# EAGLE design rev09 (EAGLE 6.5.0)
CrypTech avalanche noise prototype Revision 08-STM32 (c) NORDUnet A/S 2014
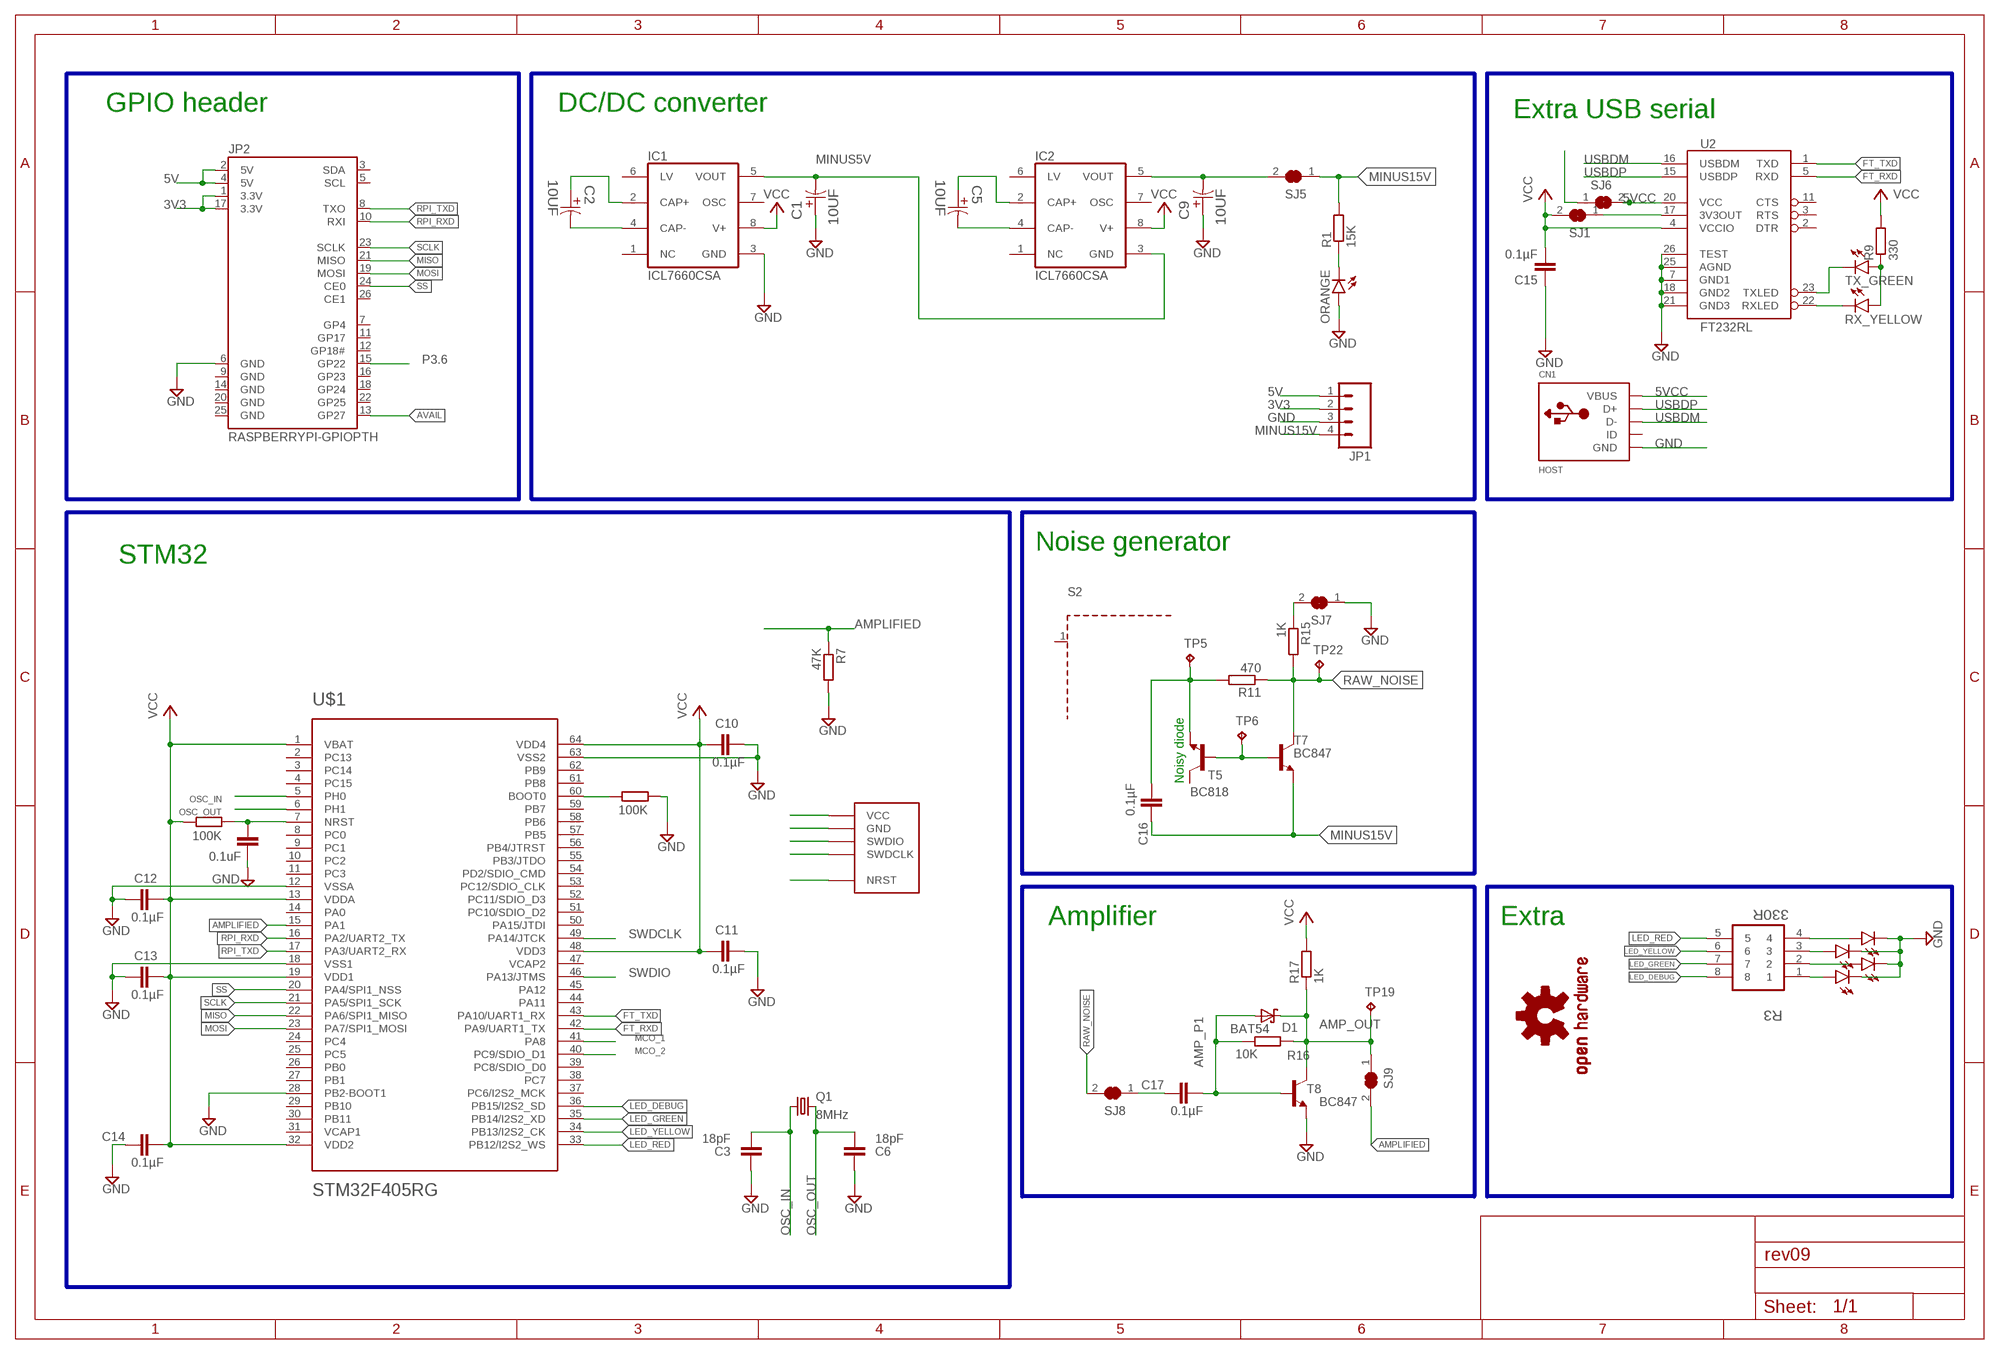
[diagram p0: schematic, sheet 1]

## Parts
C1  10UF  EEE-HA1E100R-CASE-C  [CAPAE530X610N]
C2  10UF  EEE-HA1E100R-CASE-C  [CAPAE530X610N]
C3  18pF  C-EUC0603  [C0603]
C4  0.1uF  C-EUC0603  [C0603]
C5  10UF  EEE-HA1E100R-CASE-C  [CAPAE530X610N]
C6  18pF  C-EUC0603  [C0603]
C9  10UF  EEE-HA1E100R-CASE-C  [CAPAE530X610N]
C10  0.1µF  C-EUC0603  [C0603]
C11  0.1µF  C-EUC0603  [C0603]
C12  0.1µF  C-EUC0603  [C0603]
C13  0.1µF  C-EUC0603  [C0603]
C14  0.1µF  C-EUC0603  [C0603]
C15  0.1µF  C-EUC0603  [C0603]
C16  0.1µF  C-EUC0603  [C0603]
C17  0.1µF  C-EUC0603  [C0603]
CN1  HOST  USBMINIB  [USB-MINIB]
D1  BAT54  [SOT23]
IC1  ICL7660CSA  [SO08]
IC2  ICL7660CSA  [SO08]
JP1  M04LOCK  [1X04_LOCK]
JP2  RASPBERRYPI-GPIOPTH  [2X13-SHROUDED]
LED5  LED0603  [LED-0603]
LED6  LED0603  [LED-0603]
LED7  LED0603  [LED-0603]
LED8  LED0603  [LED-0603]
LOGO1  OSHW-LOGOL  [OSHW-LOGO-L]
ORANGE  LED0603  [LED-0603]
Q1  8MHz  CRYSTALCTS406  [CTS406]
R1  15K  R-EU_R0603  [R0603]
R2  100K  R-EU_R0603  [R0603]
R3  330R  EXB38V331JV  [RESCAXE80P320X160X60-8N]
R7  47K  R-EU_R0603  [R0603]
R8  100K  R-EU_R0603  [R0603]
R9  330  R-EU_R0603  [R0603]
R11  470  R-EU_R0603  [R0603]
R15  1K  R-EU_R0603  [R0603]
R16  10K  R-EU_R0603  [R0603]
R17  1K  R-EU_R0603  [R0603]
RX_YELLOW  LED0603  [LED-0603]
S2  WE-SHC_36103205  [WE-SHC_36103205]
SJ1  SOLDERJUMPER_CLOSED  [SOLDERJUMPER_CLOSEDWIRE]
SJ5  SOLDERJUMPER_CLOSED  [SOLDERJUMPER_CLOSEDWIRE]
SJ6  SOLDERJUMPER_CLOSED  [SOLDERJUMPER_CLOSEDWIRE]
SJ7  SOLDERJUMPER_CLOSED  [SOLDERJUMPER_CLOSEDWIRE]
SJ8  SOLDERJUMPER_CLOSED  [SOLDERJUMPER_CLOSEDWIRE]
SJ9  SOLDERJUMPER_CLOSED  [SOLDERJUMPER_CLOSEDWIRE]
T5  BC818  BC818-40SMD  [SOT23-BEC]
T7  BC847  [SOT23]
T8  BC847  [SOT23]
TP5  TPB1,27  [B1,27]
TP6  TPB1,27  [B1,27]
TP19  TPB1,27  [B1,27]
TP22  TPB1,27  [B1,27]
TX_GREEN  LED0603  [LED-0603]
U2  FT232RL  FT232RL-BASICSSOP  [SSOP28DB]
U$1  STM32F405RG  [TQFP64]
U$2  STM32-SWD  [100MIL_THT]

## Nets
3V3: C10.1 C11.1 C12.2 C13.2 C14.2 C15.2 JP1.2 JP2.1(3.3V) JP2.17(3.3V) R2.2 R17.2 SJ1.2 U2.4(VCCIO) U$1.1(VBAT) U$1.13(VDDA) U$1.19(VDD1) U$1.32(VDD2) U$1.48(VDD3) U$1.64(VDD4) U$2.P$VCC(VCC) ; supply symbol labelled VCC
3V3OUT: R9.2 SJ1.1 U2.17(3V3OUT) ; supply symbol labelled VCC
5V: IC1.8(V+) IC2.8(V+) JP1.1 JP2.2(5V) JP2.4(5V) SJ6.1 ; supply symbol labelled VCC
5VCC: CN1.VBUS SJ6.2 U2.20(VCC)
AMP_OUT: D1.3(C) R16.2 R17.1 SJ9.1 T8.3(C) TP19.TP
AMP_P1: C17.2 D1.1(A) R16.1 T8.1(B)
AMPLIFIED: R7.1 SJ9.2 U$1.15(PA1)
AVAIL: JP2.13(GP27)
BOOT0: R8.2 U$1.60(BOOT0)
FT_RXD: U2.5(RXD) U$1.42(PA9/UART1_TX)
FT_TXD: U2.1(TXD) U$1.43(PA10/UART1_RX)
GND: C1.1 C3.1 C4.1 C6.1 C9.1 C10.2 C11.2 C12.1 C13.1 C14.1 C15.1 CN1.GND IC1.3(GND) JP1.3 JP2.6(GND) LED5.C LED6.C LED7.C LED8.C ORANGE.A R7.2 R8.1 SJ7.1 T8.2(E) U2.7(GND1) U2.18(GND2) U2.21(GND3) U2.25(AGND) U2.26(TEST) U$1.12(VSSA) U$1.18(VSS1) U$1.28(PB2-BOOT1) U$1.63(VSS2) U$2.P$GND(GND)
LED_DEBUG: R3.8 U$1.36(PB15/I2S2_SD)
LED_GREEN: R3.7 U$1.35(PB14/I2S2_XD)
LED_RED: R3.5 U$1.33(PB12/I2S2_WS)
LED_YELLOW: R3.6 U$1.34(PB13/I2S2_CK)
MCO_1: U$1.41(PA8)
MCO_2: U$1.40(PC9/SDIO_D1)
MINUS5V: C1.2 IC1.5(VOUT) IC2.3(GND)
MINUS15V: C16.1 JP1.4 R1.2 SJ5.1 T7.2(E)
MINUS15V_1: C9.2 IC2.5(VOUT) SJ5.2
MISO: JP2.21(MISO) U$1.22(PA6/SPI1_MISO)
MOSI: JP2.19(MOSI) U$1.23(PA7/SPI1_MOSI)
N$1: C5.2 IC2.4(CAP-)
N$2: C2.2 IC1.4(CAP-)
N$3: C2.1 IC1.2(CAP+)
N$7: ORANGE.C R1.1
N$9: C5.1 IC2.2(CAP+)
N$11: RX_YELLOW.C U2.22(RXLED)
N$12: TX_GREEN.C U2.23(TXLED)
N$13: R9.1 RX_YELLOW.A TX_GREEN.A
N$14: R15.1 SJ7.2
N$18: LED5.A R3.4
N$19: LED6.A R3.3
N$20: LED7.A R3.2
N$21: LED8.A R3.1
NOISE_IN1: C16.2 R11.2 T5.E TP5.TP
NOISE_OUT1: T5.B T7.1(B) TP6.TP
NRST: C4.2 R2.1 U$1.7(NRST) U$2.P$NRST(NRST)
OSC_IN: C3.2 Q1.1 U$1.5(PH0)
OSC_OUT: C6.2 Q1.3 U$1.6(PH1)
P3.6: JP2.15(GP22)
RAW_NOISE: R11.1 R15.2 SJ8.2 T7.3(C) TP22.TP
RAW_NOISE1: C17.1 SJ8.1
RPI_RXD: JP2.10(RXI) U$1.16(PA2/UART2_TX)
RPI_TXD: JP2.8(TXO) U$1.17(PA3/UART2_RX)
SCLK: JP2.23(SCLK) U$1.21(PA5/SPI1_SCK)
SS: JP2.24(CE0) U$1.20(PA4/SPI1_NSS)
SWDCLK: U$1.49(PA14/JTCK) U$2.P$SWDCLK(SWDCLK)
SWDIO: U$1.46(PA13/JTMS) U$2.P$SWDIO(SWDIO)
USBDM: CN1.D- U2.16(USBDM)
USBDP: CN1.D+ U2.15(USBDP)
Unconnected: CN1.ID IC1.1(NC) IC1.6(LV) IC1.7(OSC) IC2.1(NC) IC2.6(LV) IC2.7(OSC) JP2.3(SDA) JP2.5(SCL) JP2.7(GP4) JP2.11(GP17) JP2.12(GP18#) JP2.16(GP23) JP2.18(GP24) JP2.22(GP25) JP2.26(CE1) T5.C U2.2(DTR) U2.3(RTS) U2.11(CTS) U$1.2(PC13) U$1.3(PC14) U$1.4(PC15) U$1.8(PC0) U$1.9(PC1) U$1.10(PC2) U$1.11(PC3) U$1.14(PA0) U$1.24(PC4) U$1.25(PC5) U$1.26(PB0) U$1.27(PB1) U$1.29(PB10) U$1.30(PB11) U$1.31(VCAP1) U$1.37(PC6/I2S2_MCK) U$1.38(PC7) U$1.39(PC8/SDIO_D0) U$1.44(PA11) U$1.45(PA12) U$1.47(VCAP2) U$1.50(PA15/JTDI) U$1.51(PC10/SDIO_D2) U$1.52(PC11/SDIO_D3) U$1.53(PC12/SDIO_CLK) U$1.54(PD2/SDIO_CMD) U$1.55(PB3/JTDO) U$1.56(PB4/JTRST) U$1.57(PB5) U$1.58(PB6) U$1.59(PB7) U$1.61(PB8) U$1.62(PB9)

## Buses
B$1
B$2
B$3
B$4
B$5
B$7
B$6

## Notes on the sheet
- GPIO header | DC/DC converter | Extra USB serial
- Noise generator
- STM32
- Noisy diode
- Amplifier | Extra

## Power pins joined to a net without a drawn wire
GND: JP2.9(GND) JP2.14(GND) JP2.20(GND) JP2.25(GND) S2.1(GND)

## Library data of the parts
C1 C2 C5 C9 = Panasonic-EEEFT_EEEH:EEE-: Aluminum Electrolytic Capacitors,Surface Mount Type; MPN: EEE-HA1E100R; OC_FARNELL: 1973321; OC_NEWARK: 58T9232; PACKAGE: CASE-C; SUPPLIER: PANASONIC; TOLERANCE: ±20 %; VOLTAGERATING: 25V
C3 C4 C6 C10-C17 = rcl:C-EU: CAPACITOR, European symbol
CN1 = adafruit:USB: USB Connectors USBMINIB - Surface Mount Female Mini-B USB Connector 4UConnector: 06564 By microbuilder.eu Thru-hole RA Female Mini-B USB Connector 4UConnector: 18732 By ladyada.net
D1 = diode:BAT54: Schottky Diodes Source: Fairchild .. BAT54.pdf
IC1 IC2 = maxim:ICL7660CSA: VOLTAGE CONVERTER; MF: MAXIM; MPN: ICL7660CSA; OC_FARNELL: 9724710; OC_NEWARK: 34C3732
JP1 = SparkFun-Connectors:M04: Header 4 Standard 4-pin 0.1" header. Use with straight break away headers (SKU : PRT-00116), right angle break away headers (PRT-00553), swiss pins (PRT-00743), machine pins (PRT-00117), and female headers (PRT-00115). Molex polarized connector foot print use with SKU : PRT-08231 with associated crimp pins and housings. 1MM SMD Version SKU: PRT-10208
JP2 = SparkFun-Boards:RASPBERRYPI-GPIO: RASPBERRY PI I/O HEADER As defined for the Revistion 2 Pi.; DIST: sparkfun; DIST_ID: PRT-11490
LED5-LED8 ORANGE RX_YELLOW TX_GREEN = SparkFun-LED:LED: LEDs Standard schematic elements and footprints for 5mm, 3mm, 1206, and 0603 sized LEDs. 5mm - Spark Fun Electronics SKU : COM-00529 (and others)
LOGO1 = SparkFun-Aesthetics:OSHW-LOGO: Open Source Hardware Logo This logo indicates the piece of hardware it is found on incorporates a OSHW license and/or adheres to the definition of open source hardware found here: http://freedomdefined.org/OSHW
Q1 = adafruit:CRYSTAL: CRYSTAL; OC_FARNELL: unknown; OC_NEWARK: unknown
R1 R2 R7-R9 R11 R15-R17 = resistor:R-EU_: RESISTOR, European symbol
R3 = Panasonic-EXB-ERJ:EXB38V: Chip Resistor Array; MPN: EXB38V331JV; OC_FARNELL: 2060095; OC_NEWARK: 65T9098; PACKAGE: 0603; POWERRATING: 0.063 W/element; SUPPLIER: PANASONIC; TOLERANCE: ±5 %
S2 = WE-SHC:WE-SHC: WE-SHC Shielding cabinet; MPN: 36103205; OC_FARNELL: 1909657; OC_NEWARK: 58T2480; PACKAGE: Frame_SMD; SUPPLIER: Wuerth Elektronik
SJ1 SJ5-SJ9 = microbuilder:SOLDERJUMPER_CLOSED: Solder Jumper - Closed These solder jumpers are closed by default CLOSEDWIRE - 10 mil trace between pads that can be cut and resoldered later CLOSEDPERM - 63 mil trace between pads for a permanent connection (used to 'bridge' two signals, a shameless hack for Eagle). Can double as a test point as well (no cream layer)
T5 = transistor-npn:BC818*: NPN Transistor
T7 T8 = transistor:BC847: NPN TRANSISTOR
TP5 TP6 TP19 TP22 = testpad:TP: Test pad
U2 = SparkFun:FT232RL-BASIC: USB UART This is the simplified version of the FT232RL unit. Only what you need, nothing you don't. Spark Fun Electronics SKU : COM-00650
U$1 = SparkFun-DigitalIC:STM32F405RG: ARM DSP Chip used on the WAV Trigger board.
U$2 = STM32-SWD-connector:STM32-SWD: STM32 SWD connector

## Net classes
1 Ground: width 0.203 mm, drill 0.61 mm

## Board
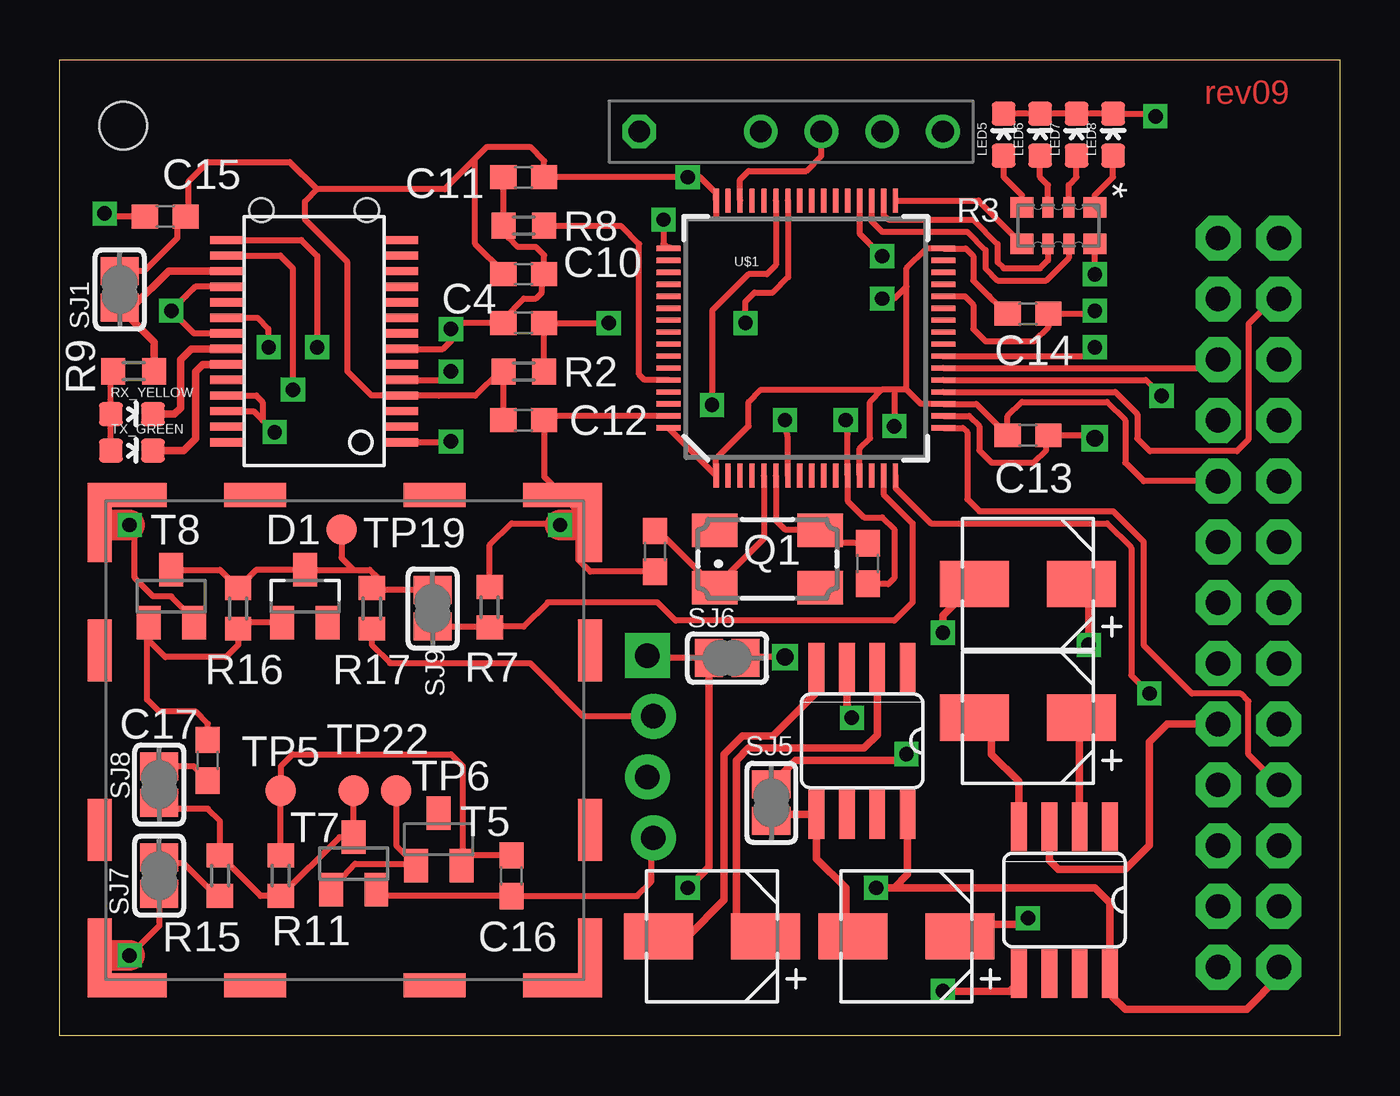
[diagram p1: board, top side]
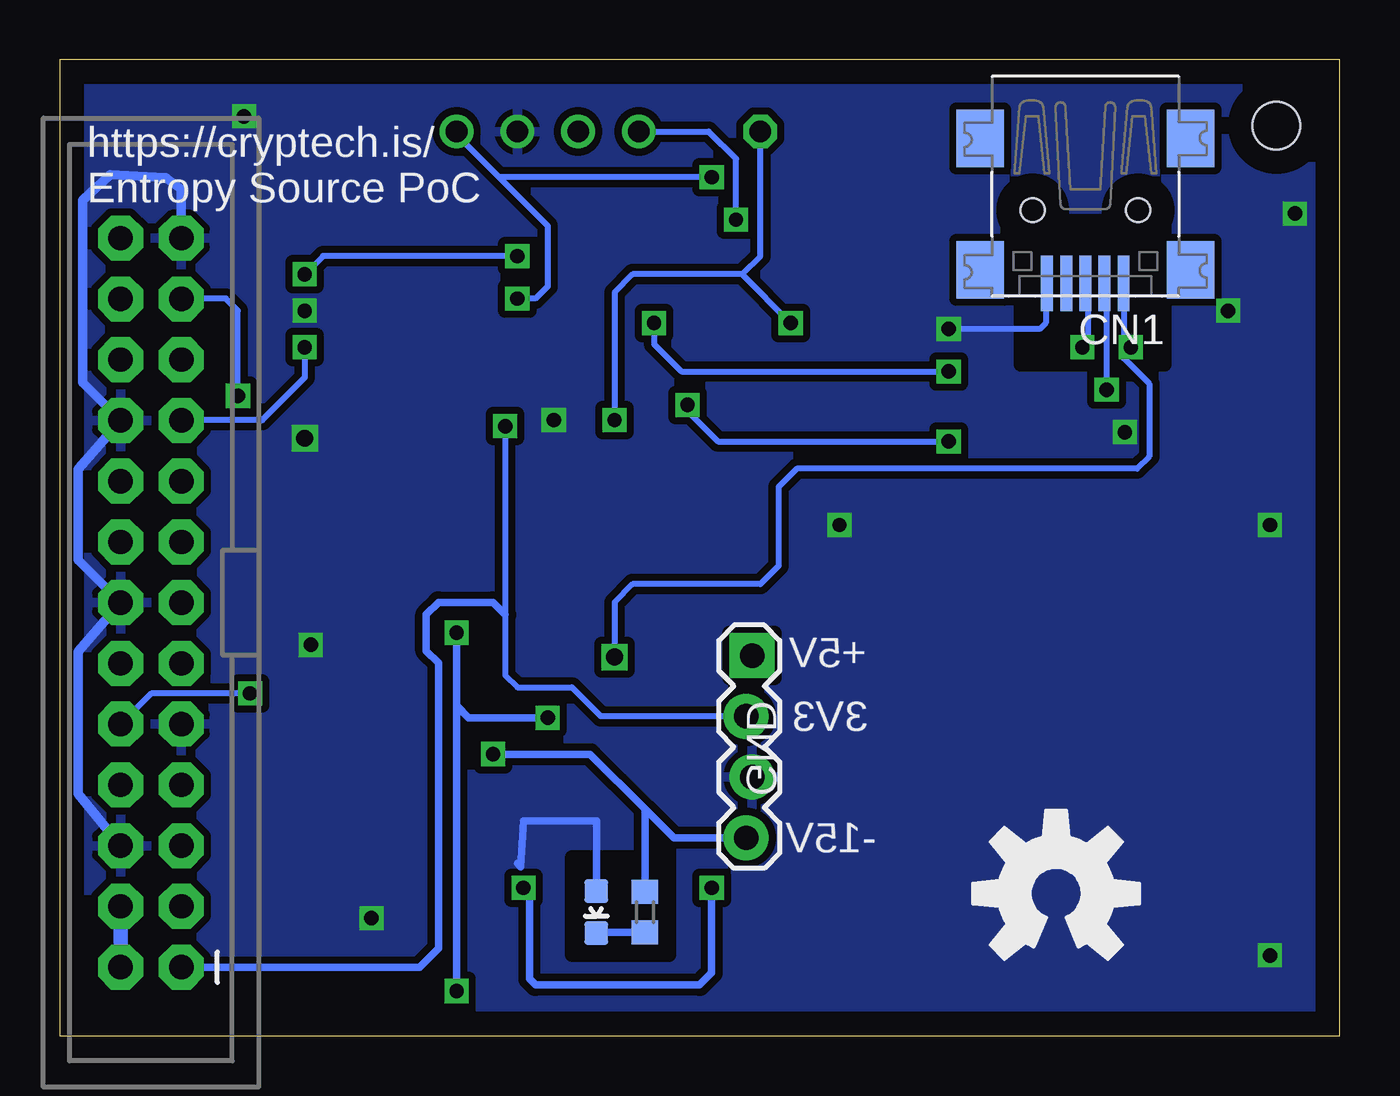
[diagram p2: board, bottom side, seen from below]

Size 53.51 x 40.81 mm. Coordinates in mm from the lower left corner, seen from the top.
Outline: 53.51,0 0,0 0,40.81 53.51,40.81 53.51,0
Copper layers (1*16): Top 0.035mm / dielectric 1.5mm / Bottom 0.035mm
Design rules "cogra": minimum track width 10mil, minimum drill 0.3mm, track to track 8mil, track to pad 8mil, pad to pad 8mil, via to via 8mil, smd to smd 8mil, copper to edge 40mil, drill to drill 8mil, minimum pad ring 10mil, minimum via ring 8mil, stop-mask expansion 4mil, vias tented up to drill 0mil, thermal gap 10mil
Holes 2 mm at 2.65,38.06
bRestrict: area 7.3,28.1 to 13.3,34.1; area 28,3.4 to 32.1,7.5

### Footprints (pad centres in the part's own frame; a part is rotated, then mirrored left to right if it is on the bottom)
CAPAE530X610N = smd 2.896 x 1.93: 1 -2.235,0; 2 2.235,0
C0603 = smd 1.1 x 1: 1 -0.85,0; 2 0.85,0
USB-MINIB = smd 0.5 x 2.308: D+ 0,4.064; D- -0.8,4.064; GND 1.6,4.064; ID 0.8,4.064; VBUS -1.6,4.064 | smd 2 x 2.4: GND1 -4.4,-2; GND2 -4.4,3.5; GND3 4.4,3.5; GND4 4.4,-2 | hole 1: -2.2,1; 2.2,1
SOT23 = smd 1 x 1.4: 1 -0.95,-1.1; 2 0.95,-1.1; 3 0,1.1
SO08 = smd 0.66 x 2.032: 1 -1.905,-3.073; 2 -0.635,-3.073; 3 0.635,-3.073; 4 1.905,-3.073; 5 1.905,3.073; 6 0.635,3.073; 7 -0.635,3.073; 8 -1.905,3.073
1X04_LOCK = drill 1.016 pad 1.88 square: 1 0,0.127 | drill 1.016 pad 1.88: 2 2.54,-0.127; 3 5.08,0.127; 4 7.62,-0.127
2X13-SHROUDED = drill 1.016 pad 1.88 octagon: 1 -1.27,15.24; 2 1.27,15.24; 3 -1.27,12.7; 4 1.27,12.7; 5 -1.27,10.16; 6 1.27,10.16; 7 -1.27,7.62; 8 1.27,7.62; 9 -1.27,5.08; 10 1.27,5.08; 11 -1.27,2.54; 12 1.27,2.54; 13 -1.27,0; 14 1.27,0; 15 -1.27,-2.54; 16 1.27,-2.54; 17 -1.27,-5.08; 18 1.27,-5.08; 19 -1.27,-7.62; 20 1.27,-7.62; 21 -1.27,-10.16; 22 1.27,-10.16; 23 -1.27,-12.7; 24 1.27,-12.7; 25 -1.27,-15.24; 26 1.27,-15.24
LED-0603 = smd 1 x 1: A 0,-0.877; C 0,0.877
CTS406 = smd 1.9 x 1.4: 1 -2.2,-1.2; 2 2.2,-1.2; 3 2.2,1.2; 4 -2.2,1.2
R0603 = smd 1 x 1.1: 1 -0.85,0; 2 0.85,0
RESCAXE80P320X160X60-8N = smd 0.864 x 0.965: 1 -0.762,1.524; 4 -0.762,-1.524; 5 0.762,-1.524; 8 0.762,1.524 | smd 0.864 x 0.457: 2 -0.762,0.432; 3 -0.762,-0.432; 6 0.762,-0.432; 7 0.762,0.432
WE-SHC_36103205 = smd 3.3 x 1: 1 9.1,10.25; 6 9.1,-10.25; 9 -9.1,-10.25; 14 -9.1,10.25 | smd 1 x 3.3: 2 10.25,9.1; 5 10.25,-9.1; 10 -10.25,-9.1; 13 -10.25,9.1 | smd 1 x 2.6: 3 10.25,3.75; 4 10.25,-3.75; 11 -10.25,-3.75; 12 -10.25,3.75 | smd 2.6 x 1: 7 3.75,-10.25; 8 -3.75,-10.25; 15 -3.75,10.25; 16 3.75,10.25
SOLDERJUMPER_CLOSEDWIRE = smd 1.168 x 1.6: 1 -0.762,0; 2 0.762,0 | smd 0.61 x 0.305: WIRE 0,0
SOT23-BEC = smd 1 x 1.4: B -0.95,-1.1; C 0,1.1; E 0.95,-1.1
B1,27 = smd 1.27 x 1.27: TP 0,0
SSOP28DB = smd 0.348 x 1.397: 1 -4.225,-3.656; 2 -3.575,-3.656; 3 -2.925,-3.656; 4 -2.275,-3.656; 5 -1.625,-3.656; 6 -0.975,-3.656; 7 -0.325,-3.656; 8 0.325,-3.656; 9 0.975,-3.656; 10 1.625,-3.656; 11 2.275,-3.656; 12 2.925,-3.656; 13 3.575,-3.656; 14 4.225,-3.656; 15 4.225,3.656; 16 3.575,3.656; 17 2.925,3.656; 18 2.275,3.656; 19 1.625,3.656; 20 0.975,3.656; 21 0.325,3.656; 22 -0.325,3.656; 23 -0.975,3.656; 24 -1.625,3.656; 25 -2.275,3.656; 26 -2.925,3.656; 27 -3.575,3.656; 28 -4.225,3.656
TQFP64 = smd 0.22 x 1: 1 -3.75,-5.75; 2 -3.25,-5.75; 3 -2.75,-5.75; 4 -2.25,-5.75; 5 -1.75,-5.75; 6 -1.25,-5.75; 7 -0.75,-5.75; 8 -0.25,-5.75; 9 0.25,-5.75; 10 0.75,-5.75; 11 1.25,-5.75; 12 1.75,-5.75; 13 2.25,-5.75; 14 2.75,-5.75; 15 3.25,-5.75; 16 3.75,-5.75; 33 3.75,5.75; 34 3.25,5.75; 35 2.75,5.75; 36 2.25,5.75; 37 1.75,5.75; 38 1.25,5.75; 39 0.75,5.75; 40 0.25,5.75; 41 -0.25,5.75; 42 -0.75,5.75; 43 -1.25,5.75; 44 -1.75,5.75; 45 -2.25,5.75; 46 -2.75,5.75; 47 -3.25,5.75; 48 -3.75,5.75 | smd 1 x 0.22: 17 5.75,-3.75; 18 5.75,-3.25; 19 5.75,-2.75; 20 5.75,-2.25; 21 5.75,-1.75; 22 5.75,-1.25; 23 5.75,-0.75; 24 5.75,-0.25; 25 5.75,0.25; 26 5.75,0.75; 27 5.75,1.25; 28 5.75,1.75; 29 5.75,2.25; 30 5.75,2.75; 31 5.75,3.25; 32 5.75,3.75; 49 -5.75,3.75; 50 -5.75,3.25; 51 -5.75,2.75; 52 -5.75,2.25; 53 -5.75,1.75; 54 -5.75,1.25; 55 -5.75,0.75; 56 -5.75,0.25; 57 -5.75,-0.25; 58 -5.75,-0.75; 59 -5.75,-1.25; 60 -5.75,-1.75; 61 -5.75,-2.25; 62 -5.75,-2.75; 63 -5.75,-3.25; 64 -5.75,-3.75
100MIL_THT = drill 0.9: P$GND 0,-5.08; P$SWDCLK 0,0; P$SWDIO 0,-2.54; P$VCC 0,-7.62 | drill 0.9 octagon: P$NRST 0,5.08

### Placement (x,y rotation side)
C1  40.48,18.89 180 top
C2  40.48,13.3 180 top
C3  24.89,20.25 90 top
C4  19.4,29.81 0 top
C5  27.27,4.15 180 top
C6  33.78,19.75 90 top
C9  35.4,4.15 180 top
C10  19.4,31.84 0 top
C11  19.4,35.9 180 top
C12  19.4,25.74 180 top
C13  40.48,25.11 180 top
C14  40.48,30.19 180 top
C15  4.41,34.25 0 top
C16  18.89,6.69 90 top
C17  6.19,11.52 90 top
CN1  10.63,35.52 180 bottom
D1  10.25,18.38 0 top
IC1  42,5.68 180 top
IC2  33.54,12.33 180 top
JP1  24.69,15.9 270 bottom
JP2  49.7,18.11 180 bottom
LED5  39.46,37.68 0 top
LED6  40.99,37.68 0 top
LED7  42.51,37.68 0 top
LED8  44.04,37.68 0 top
LOGO1  11.86,5.95 0 bottom
ORANGE  31.08,5.17 180 bottom
Q1  29.59,19.94 0 top
R1  29.05,5.17 90 bottom
R2  19.4,27.78 180 top
R3  41.75,33.87 270 top
R7  17.98,17.92 90 top
R8  19.4,33.87 0 top
R9  3.09,27.79 0 top
R11  9.24,6.69 90 top
R15  6.7,6.69 90 top
R16  7.46,17.87 90 top
R17  13.05,17.87 270 top
RX_YELLOW  3.02,26 270 top
S2  11.92,12.36 0 top
SJ1  2.51,31.21 90 top
SJ5  29.75,9.74 270 top
SJ6  27.9,15.79 0 top
SJ7  4.16,6.69 90 top
SJ8  4.16,10.5 270 top
SJ9  15.59,17.87 270 top
T5  15.84,8.22 0 top
T7  12.29,7.2 0 top
T8  4.67,18.38 0 top
TP5  9.24,10.25 0 top
TP6  14.06,10.25 0 top
TP19  11.78,21.17 0 top
TP22  12.29,10.25 0 top
TX_GREEN  3.02,24.47 270 top
U2  10.63,29.05 90 top
U$1  31.19,29.17 0 top
U$2  29.3,37.81 90 top

### Tracks (layer width: path | path; a pad name or v marks a point on that pad's centre or on a via)
3V3  (via drill 0.6)
  Top 0.254: U$1.64 U$1.1 27.44,24.14 28.8,25.49 28.8,26.51 29.3,27.01 34.38,27.01 | 27.44,34.21 U$1.48 27.44,35.23 26.76,35.9 v26.26,35.9 C11.1 20.25,36.58 19.65,37.17 17.87,37.17 17.37,36.67 | 35.4,27.01 35.4,31.33 | 35.4,31.33 35.4,32.09 36.23,32.92 U$1.32 37.88,32.92 38.19,32.6 38.19,31.59 38.87,30.91 C14.2 | JP1.2 21.88,13.36 19.65,15.58 13.81,15.58 13.05,16.35 R17.2 | v34.38,30.82 34.89,30.82 35.4,31.33 | 17.37,36.67 17.37,33.11 18.55,31.93 C10.1 18.29,32.09 | 10.76,35.4 16.1,35.4 17.37,36.67 | 10.76,35.4 10.25,34.89 10.25,34.13 12.03,32.35 12.03,27.78 13.04,26.77 U2.4 15.83,26.77 15.84,26.76 17.37,26.76 18.38,27.78 R2.2 C12.2 | U$1.13 33.44,24.55 33.88,24.98 33.88,26.51 34.38,27.01 | 35.4,27.01 35.99,26.42 U$1.19 38.32,26.42 C13.2 | 35.4,27.01 34.89,27.01 | 34.89,27.01 34.38,27.01 | 39.08,25.66 C13.2 | C13.2 39.63,25.91 40.23,26.51 43.78,26.51 44.54,25.74 44.54,23.97 45.32,23.19 JP2.17 | 34.89,27.01 v34.89,25.49 | SJ1.2 3.52,31.97 4.92,33.36 4.92,34.17 C15.2 5.39,33.87 5.39,35.74 6.19,36.54 9.62,36.54 10.76,35.4
  Bottom 0.254: v26.26,35.9 35.15,35.9 | 35.15,35.9 36.92,37.68 U$2.P$VCC | 35.15,35.9 33.11,33.87 33.11,31.33 33.62,30.82 v34.38,30.82 | v34.89,25.49 34.89,17.62 34.89,15.08 34.38,14.57 32.1,14.57 30.89,13.36 JP1.2
  Bottom 0.305: JP2.1 38.46,2.87 37.69,3.65 37.69,15.58 38.19,16.09 38.19,17.62 37.69,18.12 35.4,18.12 34.89,17.62
3V3OUT
  Top 0.305: R9.2 3.94,29.01 SJ1.1 3.02,30.44 4.54,31.97 U2.17
5V  (via drill 0.6)
  Top 0.254: SJ6.1 24.67,15.79 JP1.1
  Top 0.305: JP2.2 50.97,2.46 49.62,1.11 44.54,1.11 44.04,1.61 44.04,2.48 IC1.8 43.91,5.55 43.27,6.19 34.89,6.19 | SJ6.1 27.14,7.07 v26.26,6.19 | IC2.8 35.45,6.74 34.89,6.19 | 34.89,6.19 v34.13,6.19
  Bottom 0.305: v26.26,6.19 26.26,2.63 26.76,2.12 33.62,2.12 33.88,2.38 33.88,5.93 v34.13,6.19
  Bottom 0.61: JP2.2 JP2.4
5VCC  (via drill 0.6, 0.7)
  Top 0.254: v8.73,28.79 8.73,29.55 8.26,30.02 U2.20 | v30.32,15.84 28.71,15.84 SJ6.2
  Bottom 0.254: CN1.VBUS 9.04,29.1 | 9.04,29.1 v8.73,28.79 | 9.04,29.1 9.04,28.34 7.97,27.27 7.97,24.22 8.48,23.71 22.7,23.71 23.46,22.95 23.46,19.65 24.22,18.89 29.56,18.89 30.32,18.12 30.32,16.85 30.32,16.35 v30.32,15.84
AMP_OUT
  Top 0.254: T8.3 6.7,19.48 R16.2 8.22,19.48 D1.3 12.29,19.48 | 12.29,19.48 12.96,19.48 13.3,19.14 13.3,18.97 R17.1 13.14,18.63 SJ9.1 | TP19.TP 11.78,19.99 12.29,19.48
AMP_P1
  Top 0.254: D1.1 7.72,17.28 R16.1 7.46,16.35 6.95,15.84 4.41,15.84 3.65,16.6 | 3.63,17.36 T8.1 3.65,17.21 3.65,16.6 | C17.2 6.19,13.04 5.68,13.55 4.16,13.55 3.65,14.06 3.65,16.6
AMPLIFIED
  Top 0.254: SJ9.2 17.94,17.11 R7.1 18.02,17.11 19.4,17.11 20.41,18.12 24.99,18.12 25.75,17.36 34.89,17.36 35.65,18.12 35.65,21.43 34.44,22.64 U$1.15
BOOT0
  Top 0.254: U$1.60 24.45,27.42 24.22,27.65 24.22,33.11 23.46,33.87 R8.2
FT_RXD  (via drill 0.6)
  Top 0.254: U2.5 15.99,27.42 v16.35,27.78 | U$1.42 30.45,31.71 29.81,31.08 29.05,31.08 28.67,30.7 v28.67,29.81
  Bottom 0.254: v28.67,29.81 28.67,28.92 27.53,27.78 v16.35,27.78
FT_TXD  (via drill 0.6)
  Top 0.254: U2.1 16.32,24.82 v16.35,24.86 | U$1.43 29.94,32.22 29.56,31.84 28.8,31.84 27.27,30.32 v27.27,26.38
  Bottom 0.254: v27.27,26.38 27.27,26.13 26,24.86 v16.35,24.86
GND  (via drill 0.6, 0.7)
  Top 0.254: U2.7 16.02,28.72 16.35,29.05 v16.35,29.55 16.6,29.81 C4.1 18.55,29.97 19.4,30.82 19.91,30.82 20.16,31.08 20.16,31.75 C10.2 20.25,32.64 19.91,32.98 19.14,32.98 18.76,33.36 18.76,34.04 R8.1 C11.2 | U2.26 8.1,26.12 v8.98,25.24 8.48,25.74 8.48,26.51 8.21,26.77 U2.25 | U2.21 5.61,29.37 v4.67,30.32 5.67,31.32 U2.18 | U$1.18 38.02,25.92 38.45,25.49 38.45,24.47 38.96,23.97 40.73,23.97 41.24,24.47 41.24,25.02 C13.1 43.15,25.11 v43.27,24.98 | SJ7.1 4.16,4.6 v2.92,3.36 | T8.2 5.62,17.43 4.67,18.38 3.9,18.38 3.14,19.14 3.14,21.13 v2.92,21.36 | R7.2 17.98,20.51 18.89,21.43 20.85,21.43 v20.92,21.36 21.68,22.12 | C15.1 1.75,34.25 v1.87,34.38 | U$1.28 37.84,30.92 38.19,30.57 38.19,29.55 38.7,29.05 40.73,29.05 41.33,29.64 C14.1 43.15,30.19 v43.27,30.32 | v45.81,38.44 45.7,38.56 LED8.C LED7.C LED6.C LED5.C | C6.1 33.8,18.89 34.64,18.89 34.89,19.14 34.89,21.17 34.38,21.68 33.62,21.68 32.94,22.36 U$1.12 32.94,25.15 v32.86,25.74 | U$1.63 20.42,25.92 C12.1 20.25,23.38 S2.1 | C3.1 22.18,19.4 21.68,19.9 21.68,21.36
  Top 0.305: JP2.9 46.31,13.03 45.56,12.28 45.56,7.96 44.54,6.95 41.75,6.95 41.37,7.33 IC1.3 | C9.1 37.63,4.66 40.23,4.66 v40.48,4.92 | C1.1 43.02,18.89 v43.02,16.35 | 21.68,22.12 21.5,22.12 S2.1
  Top 1.27: v2.92,3.36 1.92,3.36 | v2.92,21.36 1.92,21.36 | v20.92,21.36 21.68,21.36 21.92,21.36
  Bottom 0.254: CN1.GND 12.29,31.41 12.29,29.81 12.54,29.55 v16.35,29.55
  Bottom 0.305: ORANGE.A 31.08,8.98 34.13,8.98 34.24,7.06 34.38,7.2
  Bottom 0.406: JP2.25 48.43,35.4 49.09,35.88 51.41,36.01 52.56,34.94 52.56,27.32 JP2.20 52.75,23.7 52.75,19.89 JP2.14 52.75,16.08 52.75,10.11 JP2.6
  pour Bottom (isolate 0.305): -0.03,0.13 53.49,0.13 53.51,40.81 0,40.81
LED_DEBUG  (via drill 0.6)
  Top 0.254: U$1.36 33.44,33.54 v34.38,32.6 | v43.27,31.84 R3.8
  Bottom 0.254: v34.38,32.6 42.51,32.6 v43.27,31.84
LED_GREEN
  Top 0.254: U$1.35 33.94,34.06 34.38,33.62 37.94,33.62 38.7,32.86 38.7,32.09 39.21,31.59 41.24,31.59 42.18,32.53 R3.7
LED_RED
  Top 0.254: U$1.33 38.42,34.92 R3.5
LED_YELLOW
  Top 0.254: U$1.34 34.44,34.32 34.64,34.13 38.19,34.13 39.21,33.11 39.21,32.35 39.46,32.09 40.99,32.09 41.32,32.42 R3.6
MINUS5V  (via drill 0.6)
  Top 0.305: IC1.5 40.1,2.25 39.72,1.87 v36.92,1.87 | C1.2 36.92,17.57 v36.92,16.85 36.67,17.11 | IC2.3 32.91,13.86 v33.11,13.3
  Bottom 0.305: v36.92,1.87 36.92,13.81 | 36.92,13.81 v36.92,16.85 | v33.11,13.3 36.42,13.3 36.92,13.81
MINUS15V  (via drill 0.6)
  Top 0.254: T7.2 13.49,5.84 C16.1 24.14,5.84 24.73,6.44 24.73,8.7 JP1.4 | 35.4,11.52 v35.4,11.77
  Top 0.305: SJ5.1 30.76,11.52 35.4,11.52
  Bottom 0.305: v35.4,11.77 31.34,11.77 29.05,9.49 | 29.05,9.49 27.84,8.28 JP1.4 | R1.2 29.05,9.49
MINUS15V_1
  Top 0.305: C9.2 32.86,4.36 32.86,6.19 31.64,7.41 IC2.5 29.75,9.26 SJ5.2
MISO
  Top 0.254: U$1.22 48.43,27.92 JP2.21
MOSI  (via drill 0.6)
  Top 0.254: U$1.23 42.9,28.42 v43.27,28.79
  Bottom 0.254: v43.27,28.79 43.27,27.52 45.05,25.74 48.42,25.74 JP2.19
N$1
  Top 0.305: 24.73,4.15 C5.2 26.26,4.15 27.78,5.68 27.78,11.77 28.54,12.54 29.81,12.54 31.64,14.36 IC2.4
N$2
  Top 0.305: IC1.4 40.1,10.63 38.96,11.77 38.96,12.59 C2.2
N$3
  Top 0.305: IC1.2 42.64,13.22 C2.1
N$7
  Bottom 0.305: R1.1 30.85,4.32 ORANGE.C
N$9
  Top 0.305: C5.1 28.29,4.15 28.29,11.52 28.8,12.03 33.62,12.03 34.18,12.59 IC2.2
N$11
  Top 0.305: U2.22 5.48,28.72 5.05,28.28 5.05,26.25 4.79,26 RX_YELLOW.C
N$12
  Top 0.305: U2.23 5.98,28.07 5.68,27.78 5.68,24.98 5.17,24.47 TX_GREEN.C
N$13
  Top 0.254: TX_GREEN.A RX_YELLOW.A 2.14,27.94 R9.1
N$14
  Top 0.254: R15.1 6.53,5.84 5.17,7.2 4.41,7.2 SJ7.2
N$18
  Top 0.254: R3.4 40.23,35.14 39.46,35.9 LED5.A
N$19
  Top 0.254: R3.3 41.32,35.57 40.99,35.9 LED6.A
N$20
  Top 0.254: R3.2 42.18,35.57 42.51,35.9 LED7.A
N$21
  Top 0.254: R3.1 43.27,35.14 44.04,35.9 LED8.A
NOISE_IN1
  Top 0.254: 16.87,7.04 T5.E | T5.E 16.79,7.27 | R11.2 TP5.TP 9.24,11.27 9.75,11.77 16.35,11.77 16.86,11.27 16.86,7.27 | C16.2 17.22,7.54 T5.E
  Top 0.305: 16.79,7.27 16.86,7.27
NOISE_OUT1
  Top 0.254: T7.1 12.35,7.19 14.82,7.19 T5.B 14.06,7.95 TP6.TP
NRST  (via drill 0.6)
  Top 0.254: U$1.7 30.44,24.98 v30.32,25.74 | R2.1 C4.2 v22.95,29.81
  Bottom 0.254: U$2.P$NRST 24.22,32.6 24.99,31.84 | 24.99,31.84 29.56,31.84 30.32,31.08 v30.32,25.74 | 24.99,31.84 v22.95,29.81
OSC_IN
  Top 0.254: C3.2 25.27,20.85 Q1.1 | 27.49,18.63 Q1.1 | U$1.5 29.44,20.79 Q1.1
OSC_OUT
  Top 0.254: C6.2 32.33,20.6 Q1.3 31.75,21.17 30.32,21.17 29.94,21.55 U$1.6
RAW_NOISE
  Top 0.254: SJ8.2 4.41,9.49 6.19,9.49 6.7,8.98 R15.2 8.4,5.84 R11.1 11.7,8.3 T7.3 TP22.TP
RAW_NOISE1
  Top 0.254: C17.1 5.59,11.27 SJ8.1
RPI_RXD  (via drill 0.6)
  Top 0.254: v45.56,14.31 44.8,15.08 44.8,20.41 43.78,21.43 36.42,21.43 34.94,22.9 U$1.16
  Bottom 0.254: v45.56,14.31 49.69,14.31 JP2.10
RPI_TXD
  Top 0.254: U$1.17 37.76,25.42 37.94,25.24 37.94,22.44 38.45,21.93 44.04,21.93 45.31,20.66 45.31,16.35 47.34,14.31 49.37,14.31 49.7,13.98 49.7,11.76 JP2.8
SCLK  (via drill 0.6)
  Top 0.254: 48.42,30.82 JP2.23 | U$1.21 45.41,27.42 v46.07,26.76
  Bottom 0.254: v46.07,26.76 46.07,30.32 46.58,30.82 48.42,30.82 JP2.23
SS
  Top 0.254: U$1.20 44.13,26.92 45.05,26 45.05,24.98 45.59,24.45 49.22,24.45 49.7,24.93 49.7,29.76 50.75,30.81 JP2.24
SWDCLK  (via drill 0.6)
  Top 0.254: 25.49,32.97 U$1.49 25.24,33.12 v25.24,34.13
  Bottom 0.254: U$2.P$SWDCLK 26.38,37.81 25.24,36.67 v25.24,34.13
SWDIO
  Top 0.254: U$1.46 28.44,35.8 28.8,36.16 31.21,36.16 31.84,36.79 U$2.P$SWDIO
USBDM  (via drill 0.6)
  Top 0.254: U2.16 9.22,32.62 9.75,32.09 v9.75,27.01
  Bottom 0.254: v9.75,27.01 9.75,31.24 CN1.D-
USBDP  (via drill 0.6)
  Top 0.254: U2.15 10.09,33.27 10.76,32.6 v10.76,28.79
  Bottom 0.254: v10.76,28.79 10.51,29.05 10.51,31.21 CN1.D+

### Text on the board
Top: rev09
bNames: https://cryptech.is/ / Entropy Source PoC | +5V | 3V3 | GND | -15V
tValues: RED | YE | GR | BLUE
bValues: NRST | CLK | IO | GND | VCC | rev09